# EAGLE schematic airball_sensor_board_v2 (EAGLE 8.5.1)
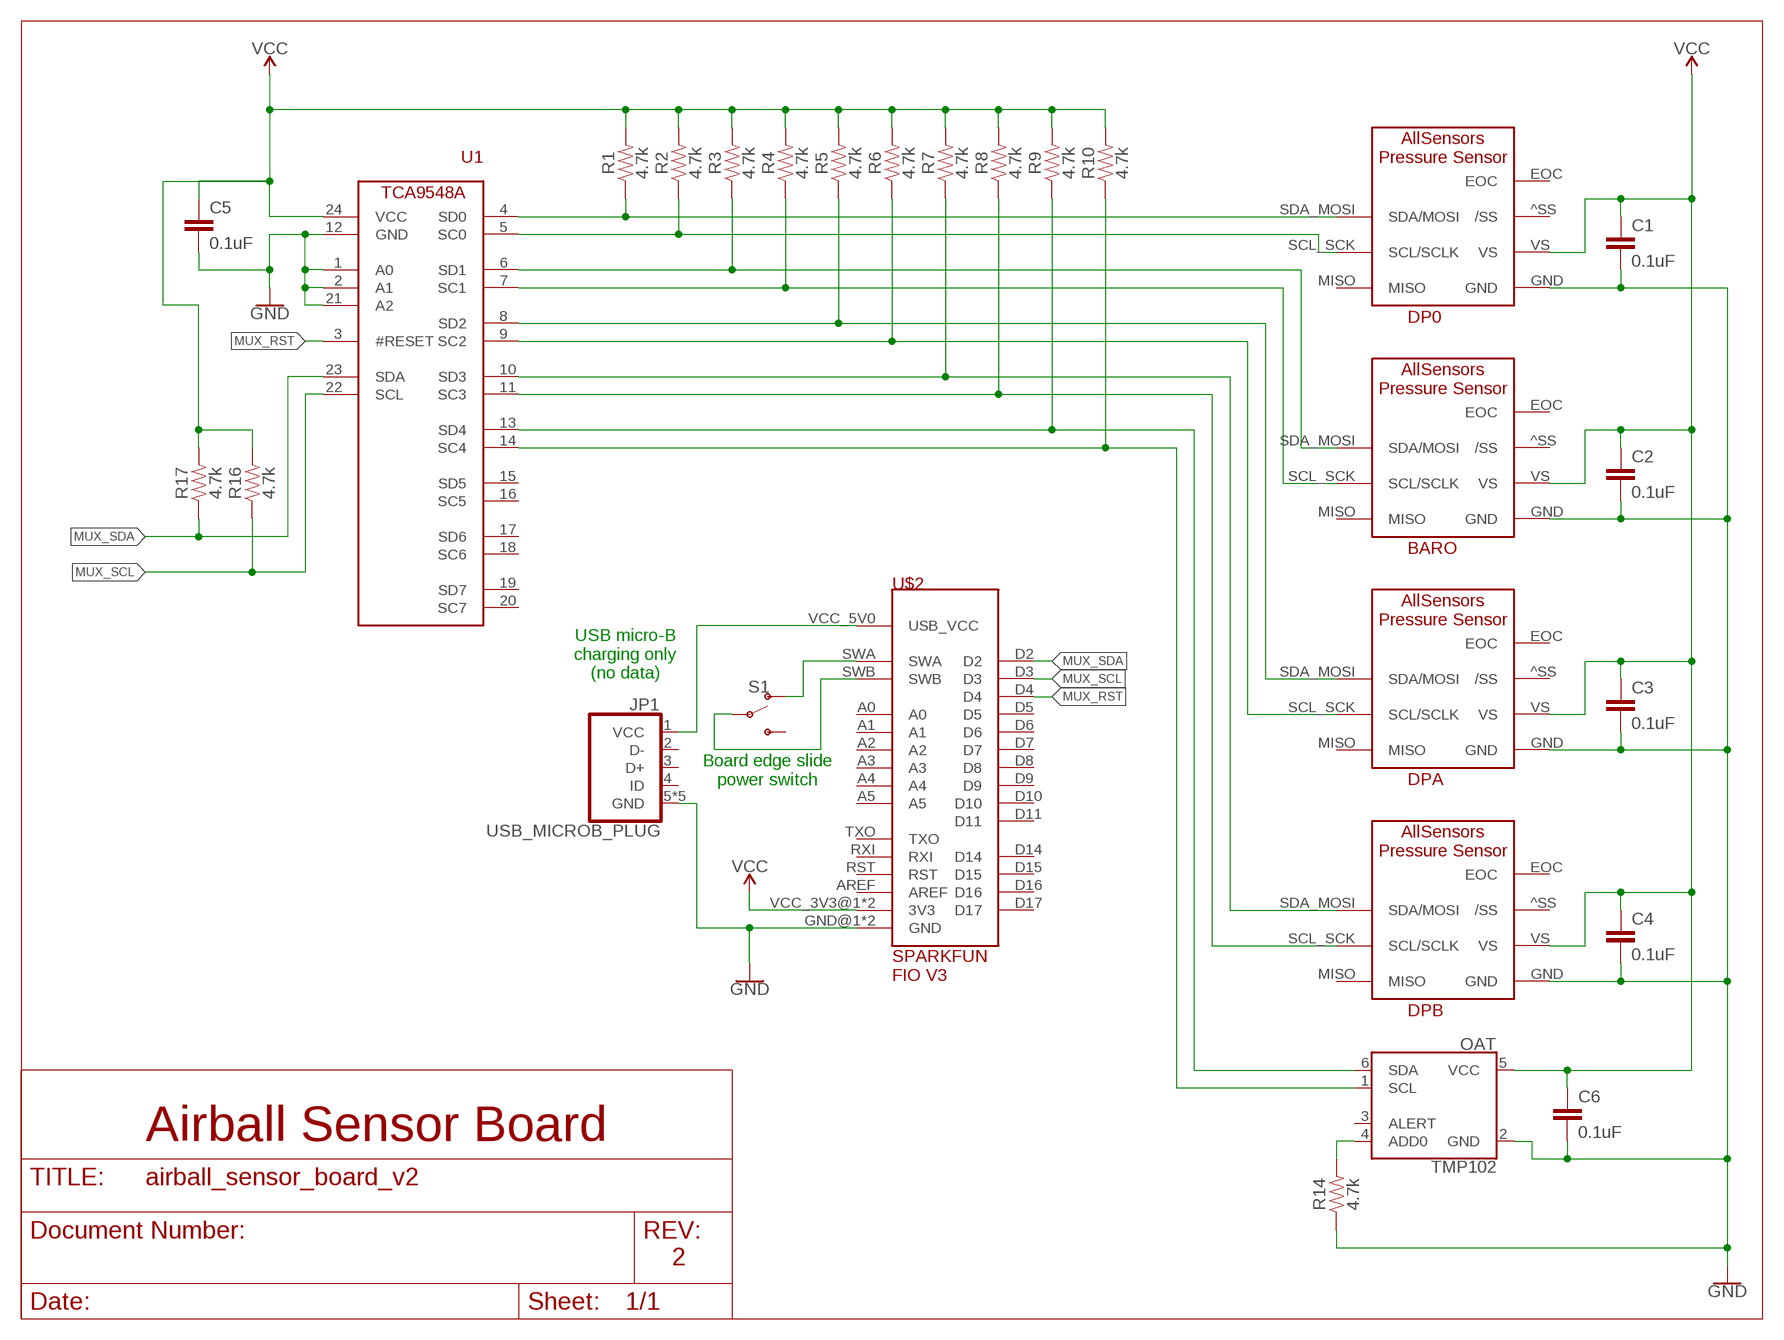
[diagram p0: schematic, sheet 1]

## Parts
BARO  ALL_SENSORS_DLHR_E1ND  [ALL_SENSORS_E1BD_8PIN_THRU]
C1  0.1uF  0.1UF-0603-25V-5%  [0603]
C2  0.1uF  0.1UF-0603-25V-5%  [0603]
C3  0.1uF  0.1UF-0603-25V-5%  [0603]
C4  0.1uF  0.1UF-0603-25V-5%  [0603]
C5  0.1uF  0.1UF-0603-25V-5%  [0603]
C6  0.1uF  0.1UF-0603-25V-5%  [0603]
DP0  ALL_SENSORS_DLHR_E1ND  [ALL_SENSORS_E1BD_8PIN_THRU]
DPA  ALL_SENSORS_DLHR_E1ND  [ALL_SENSORS_E1BD_8PIN_THRU]
DPB  ALL_SENSORS_DLHR_E1ND  [ALL_SENSORS_E1BD_8PIN_THRU]
JP1  USB_MICROB_PLUG  [USB_MICRO_B_TYCO]
OAT  TMP102  [SOT563]
R1  4.7k  4.7KOHM-0603-1/10W-1%  [0603]
R2  4.7k  4.7KOHM-0603-1/10W-1%  [0603]
R3  4.7k  4.7KOHM-0603-1/10W-1%  [0603]
R4  4.7k  4.7KOHM-0603-1/10W-1%  [0603]
R5  4.7k  4.7KOHM-0603-1/10W-1%  [0603]
R6  4.7k  4.7KOHM-0603-1/10W-1%  [0603]
R7  4.7k  4.7KOHM-0603-1/10W-1%  [0603]
R8  4.7k  4.7KOHM-0603-1/10W-1%  [0603]
R9  4.7k  4.7KOHM-0603-1/10W-1%  [0603]
R10  4.7k  4.7KOHM-0603-1/10W-1%  [0603]
R14  4.7k  4.7KOHM-0603-1/10W-1%  [0603]
R16  4.7k  4.7KOHM-0603-1/10W-1%  [0603]
R17  4.7k  4.7KOHM-0603-1/10W-1%  [0603]
S1  SWITCH-SPDT-SMD-RIGHT-ANGLE  [SWITCH_SPST_SMD_A]
U1  TCA9548ATSSOP24  [TSSOP24]
U$2  SPARKFUN_FIO_V3  [SPARKFUN_FIO_V3]

## Nets
GND [power]: BARO.GND C1.2 C2.2 C3.2 C4.2 C5.2 C6.2 DP0.GND DPA.GND DPB.GND JP1.5(GND) JP1.SH@1(GND) JP1.SH@2(GND) JP1.SH@3(GND) JP1.SH@4(GND) OAT.2(GND) R14.1 U1.1(A0) U1.2(A1) U1.12(GND) U1.21(A2) U$2.GND@1(GND) U$2.GND@2(GND)
MUX_RST: U1.3(#RESET) U$2.D4
MUX_SCL: R16.1 U1.22(SCL) U$2.D3
MUX_SDA: R17.1 U1.23(SDA) U$2.D2
OAT_ADD0: OAT.4(ADD0) R14.2
SCL_BARO: BARO.SCL_SCK(SCL/SCLK) R4.1 U1.7(SC1)
SCL_DP0: DP0.SCL_SCK(SCL/SCLK) R2.1 U1.5(SC0)
SCL_DPA: DPA.SCL_SCK(SCL/SCLK) R6.1 U1.9(SC2)
SCL_DPB: DPB.SCL_SCK(SCL/SCLK) R8.1 U1.11(SC3)
SCL_OAT: OAT.1(SCL) R10.1 U1.14(SC4)
SDA_BARO: BARO.SDA_MOSI(SDA/MOSI) R3.1 U1.6(SD1)
SDA_DP0: DP0.SDA_MOSI(SDA/MOSI) R1.1 U1.4(SD0)
SDA_DPA: DPA.SDA_MOSI(SDA/MOSI) R5.1 U1.8(SD2)
SDA_DPB: DPB.SDA_MOSI(SDA/MOSI) R7.1 U1.10(SD3)
SDA_OAT: OAT.6(SDA) R9.1 U1.13(SD4)
SWA [power]: S1.1(O) U$2.SWA
SWB [power]: S1.2(P) U$2.SWB
VCC_3V3 [power]: BARO.VS C1.1 C2.1 C3.1 C4.1 C5.1 C6.1 DP0.VS DPA.VS DPB.VS OAT.5(VCC) R1.2 R2.2 R3.2 R4.2 R5.2 R6.2 R7.2 R8.2 R9.2 R10.2 R16.2 R17.2 U1.24(VCC) U$2.VCC_3V3@1(3V3) U$2.VCC_3V3@2(3V3) ; supply symbol labelled VCC
VCC_USB [power]: JP1.1(VCC) U$2.VCC_5V0(USB_VCC)
Unconnected: BARO.^SS(/SS) BARO.EOC BARO.MISO DP0.^SS(/SS) DP0.EOC DP0.MISO DPA.^SS(/SS) DPA.EOC DPA.MISO DPB.^SS(/SS) DPB.EOC DPB.MISO JP1.2(D-) JP1.3(D+) JP1.4(ID) OAT.3(ALERT) S1.3(S) U1.15(SD5) U1.16(SC5) U1.17(SD6) U1.18(SC6) U1.19(SD7) U1.20(SC7) U$2.A0 U$2.A1 U$2.A2 U$2.A3 U$2.A4 U$2.A5 U$2.AREF U$2.D5 U$2.D6 U$2.D7 U$2.D8 U$2.D9 U$2.D10 U$2.D11 U$2.D14 U$2.D15 U$2.D16 U$2.D17 U$2.RST U$2.RXI U$2.TXO

## Notes on the sheet
- USB micro-B
  charging only
  (no data)
- Board edge slide
  power switch
- Airball Sensor Board
- 2

## Library data of the parts
BARO DP0 DPA DPB = microbuilder:ALL_SENSORS_DLHR_E1ND: All Sensors DLHR sensor, E1ND package 8 pin DIP 100 mil pin spacing 600 mil between pin rows 2 barbed pressure ports, same side
C1-C6 = SparkFun-Capacitors:0.1UF: 0.1µF ceramic capacitors A capacitor is a passive two-terminal electrical component used to store electrical energy temporarily in an electric field.; PROD_ID: CAP-08604
JP1 = jcole:USB_MICROB_PLUG: USB Micro-B Plug Comes in a variety of packages. Check out Hirose's ZX-x0 line: http://www.hirose.co.jp/cataloge_hp/e24200011.pdf
OAT = SparkFun-Sensors:TMP102: Texas Instruments TMP102 Low-Power Digital Temperature Sensor The TMP102 is a digital sensor (I2C a.k.a. TWI), has a resolution of 0.0625°C, and is accurate up to 0.5°C. This is a very handy sensor that requires a very low-current. Datasheet <http://www.sparkfun.com/datasheets/Sensors/Temperature/tmp102.pdf> SparkFun Products SparkFun Digital Temperature Sensor Breakout - TMP102 <https://www.sparkfun.com/products/11931> (SEN-11931); PROD_ID: IC-09303
R1-R10 R14 R16 R17 = SparkFun-Resistors:4.7KOHM: 4.7kΩ resistor A resistor is a passive two-terminal electrical component that implements electrical resistance as a circuit element. Resistors act to reduce current flow, and, at the same time, act to lower voltage levels within circuits. - Wikipedia; PROD_ID: RES-07857
S1 = SparkFun-Switches:SWITCH-SPDT: Single Pole, Double Throw (SPDT) Switch Single-pole, double-throw (SPDT) switch. Variant Overview SMD-AYZ0202 Surface Mount DPDT Switch <https://www.sparkfun.com/products/597> (COM-00597) Used on e.g. LilyPad Arduino USB - ATmega32U4 Board <https://www.sparkfun.com/products/12049> PTH-11.6X4.0MM SPDT Mini Power Switch <https://www.sparkfun.com/products/102> (COM-00102) Used on e.g. SparkFun Simon Says - Through-Hole Soldering Kit <https://www.sparkfun.com/products/10547> (KIT-10547) PTH-11.6X4.0MM-KIT KIT version of SPDT Mini Power Switch - Simplifies soldering by removing tStop of switch pins - only one side can be soldered. PTH-11.6X4.0MM-LOCK LOCK version of SPDT Mini Power Switch - Offset pins hold switch in place for easier soldering. SMD-RIGHT-ANGLE Surface Mount Right Angle Switch <https://www.sparkfun.com/products/10860> (COM-10860) Used on e.g. SparkFun ESP8266 Thing <https://www.sparkfun.com/products/13231>; PROD_ID: SWCH-10651; SF_SKU: COM-10860
U1 = microbuilder:TCA9548A: Texas Instruments TCA9548A 1-to-8 I2C multiplexer. Supported packages: TSSOP24
U$2 = microbuilder:SPARKFUN_FIO_V3

## Net classes
0 signal: width 0.152 mm
1 power: width 0.305 mm